# EAGLE design Crimson_module (EAGLE 9.4.0)
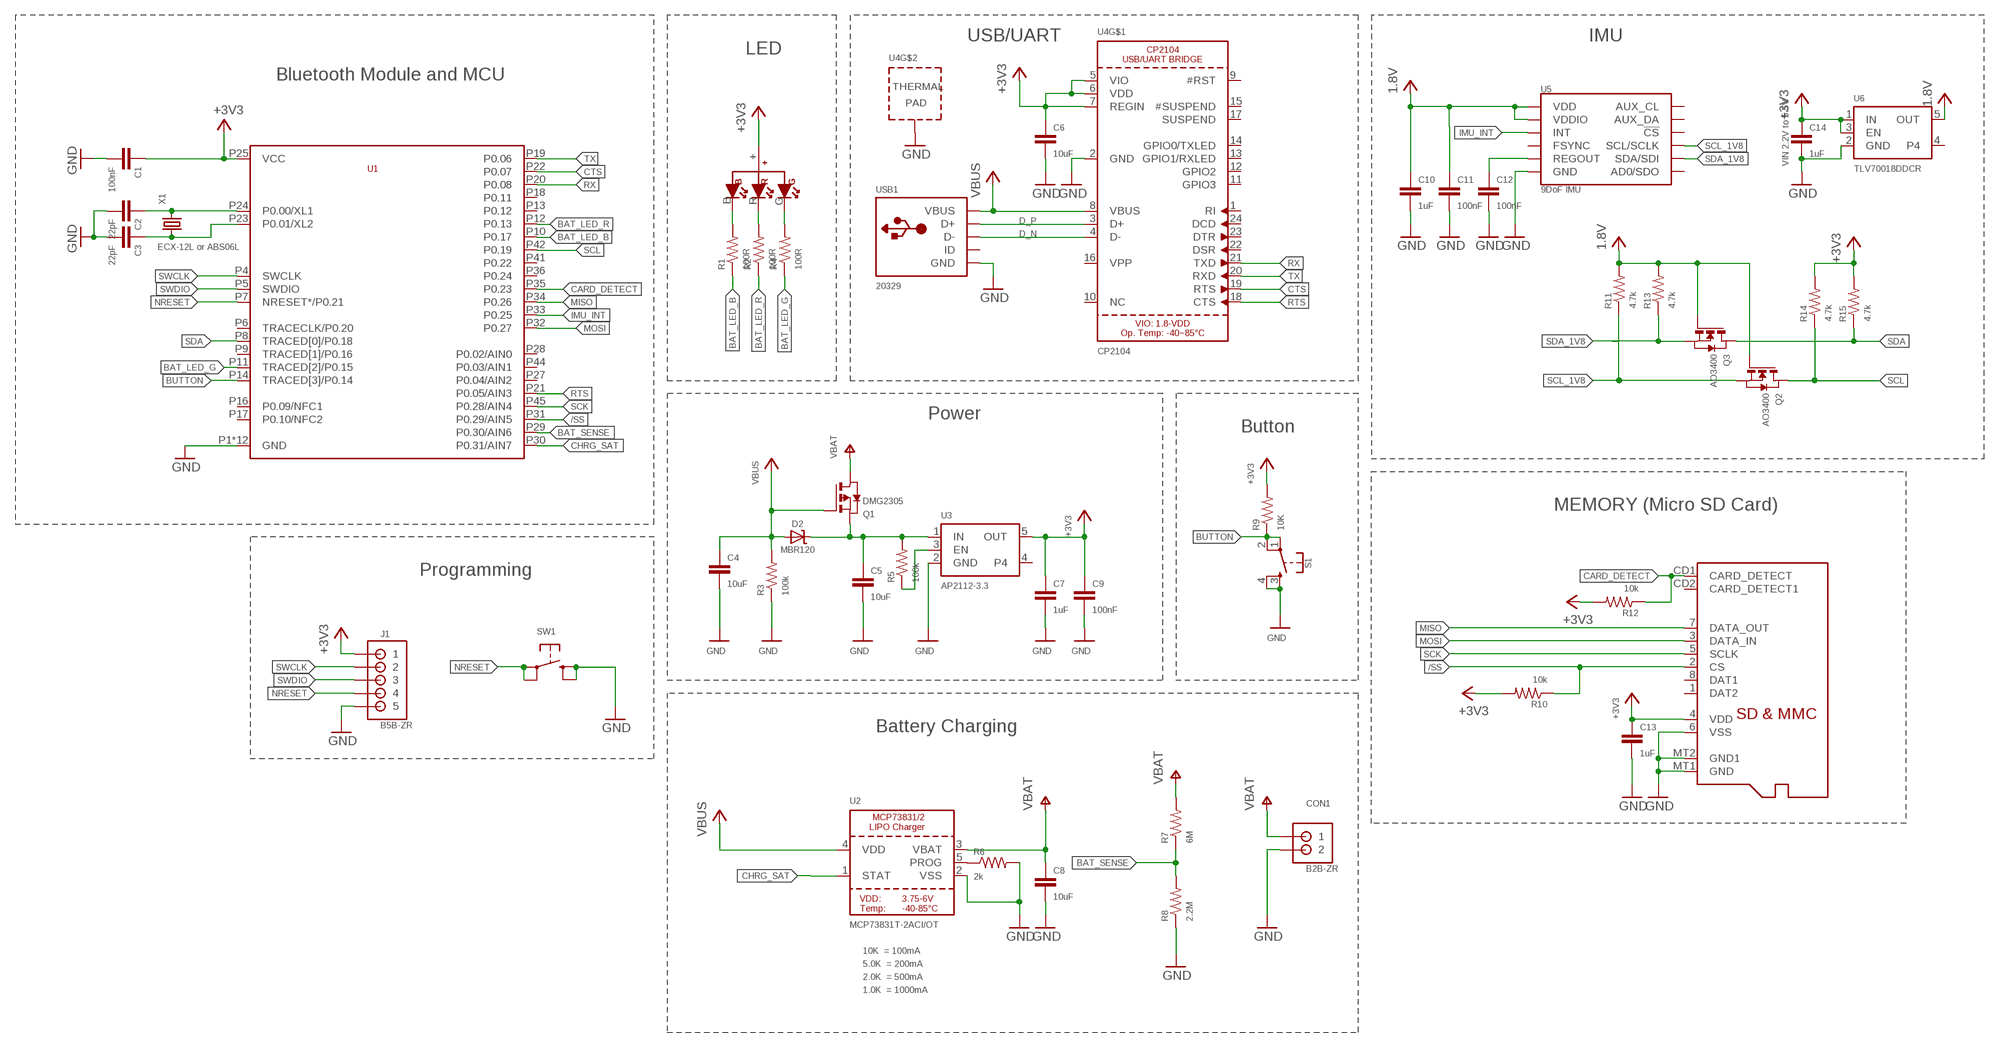
[diagram p0: schematic, sheet 1]

## Parts
C1  100nF  C-EUC0402  [C0402]
C2  22pF  C-EUC0402  [C0402]
C3  22pF  C-EUC0402  [C0402]
C4  10uF  C-EUC0402  [C0402]
C5  10uF  C-EUC0402  [C0402]
C6  10uF  C-EUC0402  [C0402]
C7  1uF  C-EUC0402  [C0402]
C8  10uF  C-EUC0402  [C0402]
C9  100nF  C-EUC0402  [C0402]
C10  1uF  C-EUC0402  [C0402]
C11  100nF  C-EUC0402  [C0402]
C12  100nF  C-EUC0402  [C0402]
C13  1uF  C-EUC0402  [C0402]
C14  1uF  C-EUC0402  [C0402]
CON1  B2B-ZR  [B2B-ZR]
D1  B2020RGBA  [B2020RGBA]
D2  MBR120  DIODE-SCHOTTKYSOD-123  [SOD-123]
J1  B5B-ZR  [B5B-ZR]
Q1  DMG2305  PMOS-SOT23  [SOT-23]
Q2  AO3400  NMOS-SOT23  [SOT-23]
Q3  AO3400  NMOS-SOT23  [SOT-23]
R1  100R  R-US_R0402  [R0402]
R2  100R  R-US_R0402  [R0402]
R3  100k  R-US_R0402  [R0402]
R4  100R  R-US_R0402  [R0402]
R5  100k  R-US_R0402  [R0402]
R6  2k  R-US_R0402  [R0402]
R7  6M  R-US_R0402  [R0402]
R8  2.2M  R-US_R0402  [R0402]
R9  10K  R-US_R0402  [R0402]
R10  10k  R-US_R0402  [R0402]
R11  4.7k  R-US_R0402  [R0402]
R12  10k  R-US_R0402  [R0402]
R13  4.7k  R-US_R0402  [R0402]
R14  4.7k  R-US_R0402  [R0402]
R15  4.7k  R-US_R0402  [R0402]
S1  MOMENTARY-SWITCH-SPST-2-SMD-5.2MM  [TACTILE_SWITCH_SMD_5.2MM]
SD1  MICROSD  [MICROSD]
SW1  MICROBUILDER_SWITCH_TACT_SMT4.6X2.8  [MICROBUILDER_BTN_KMR2_4.6X2.8]
U1  BMD-350  [BMD-350]
U2  MCP73831T-2ACI/OT  MCP73831/2  [SOT23-5]
U3  AP2112-3.3  VREG_SOT23-5  [SOT23-5]
U4  CP2104  [QFN24_4MM_SMSC]
U5  9DoF IMU  ICM-20948  [QFN24-3X3]
U6  TLV70018DDCR  MICROBUILDER_VREG_SOT23-5  [MICROBUILDER_SOT23-5]
USB1  20329  USB_MICRO_20329_V2  [4UCONN_20329_V2]
X1  ECX-12L or ABS06L  KX-327-RT  [2.0X1.2]

## Nets
+3V3: C1.1 C6.1 C7.1 C9.1 C13.1 C14.1 D1.+ J1.1 R9.2 R10.2 R12.2 R14.2 R15.2 SD1.4(VDD) U1.P25(VCC) U3.5(OUT) U4.5(VIO) U4.6(VDD) U4.7(REGIN) U6.1(IN) U6.3(EN)
+5V: C4.1 D2.A Q1.G R3.2 U2.4(VDD) U4.8(VBUS) USB1.VBUS ; supply symbol labelled VBUS
/SS: R10.1 SD1.2(CS) U1.P31(P0.29/AIN5)
BAT_LED_B: R1.1 U1.P10(P0.17)
BAT_LED_G: R4.1 U1.P11(TRACED[2]/P0.15)
BAT_LED_R: R2.1 U1.P12(P0.13)
BAT_SENSE: R7.1 R8.2 U1.P29(P0.30/AIN6)
BUTTON: R9.1 S1.1 S1.2 U1.P14(TRACED[3]/P0.14)
CARD_DETECT: R12.1 SD1.CD1(CARD_DETECT) U1.P35(P0.23)
CHRG_SAT: U1.P30(P0.31/AIN7) U2.1(STAT)
CTS: U1.P22(P0.07) U4.19(RTS)
D_N: U4.4(D-) USB1.D-
D_P: U4.3(D+) USB1.D+
EN: R5.1 U3.3(EN)
GND: C1.2 C2.2 C3.2 C4.2 C5.2 C6.2 C7.2 C8.2 C9.2 C10.2 C11.2 C12.2 C13.2 C14.2 CON1.2 J1.5 R3.1 R6.2 R8.1 S1.3 S1.4 SD1.6(VSS) SD1.MT1(GND) SD1.MT2(GND1) SW1.B'(S1) SW1.B(S) U1.P1(GND) U1.P2(GND) U1.P3(GND) U1.P15(GND) U1.P26(GND) U1.P37(GND) U1.P38(GND) U1.P39(GND) U1.P40(GND) U1.P43(GND) U1.P46(GND) U1.P47(GND) U2.2(VSS) U3.2(GND) U4.2(GND) U4.THERM(TP) U5.18(GND) U5.20(GND) U6.2(GND) USB1.BASE@1(GND) USB1.BASE@2(GND) USB1.GND USB1.SPRT@1(GND) USB1.SPRT@2(GND) USB1.SPRT@3(GND) USB1.SPRT@4(GND)
IMU_INT: U1.P33(P0.25) U5.12(INT)
MISO: SD1.7(DATA_OUT) U1.P34(P0.26)
MOSI: SD1.3(DATA_IN) U1.P32(P0.27)
N$2: R6.1 U2.5(PROG)
N$4: C12.1 U5.10(REGOUT)
N$5: C3.1 U1.P23(P0.01/XL2) X1.1
N$6: D1.B R1.2
N$7: D1.R R2.2
N$8: D1.G R4.2
N$10: C2.1 U1.P24(P0.00/XL1) X1.2
N$11: C5.1 D2.C Q1.S R5.2 U3.1(IN)
NRESET: J1.4 SW1.A'(P1) SW1.A(P) U1.P7(NRESET*/P0.21)
RTS: U1.P21(P0.05/AIN3) U4.18(CTS)
RX: U1.P20(P0.08) U4.21(TXD)
SCK: SD1.5(SCLK) U1.P45(P0.28/AIN4)
SCL: Q2.D R14.1 U1.P42(P0.19)
SCL_1V8: Q2.S R11.1 U5.23(SCL/SCLK)
SDA: Q3.D R15.1 U1.P8(TRACED[0]/P0.18)
SDA_1V8: Q3.S R13.1 U5.24(SDA/SDI)
SWCLK: J1.2 U1.P4(SWCLK)
SWDIO: J1.3 U1.P5(SWDIO)
TX: U1.P19(P0.06) U4.20(RXD)
V+: C8.1 CON1.1 Q1.D R7.2 U2.3(VBAT) ; supply symbol labelled VBAT
VCC: C10.1 C11.1 Q2.G Q3.G R11.2 R13.2 U5.8(VDDIO) U5.13(VDD) U6.5(OUT) ; supply symbol labelled 1.8V
Unconnected: SD1.1(DAT2) SD1.8(DAT1) SD1.CD2(CARD_DETECT1) U1.P6(TRACECLK/P0.20) U1.P9(TRACED[1]/P0.16) U1.P13(P0.12) U1.P16(P0.09/NFC1) U1.P17(P0.10/NFC2) U1.P18(P0.11) U1.P27(P0.04/AIN2) U1.P28(P0.02/AIN0) U1.P36(P0.24) U1.P41(P0.22) U1.P44(P0.03/AIN1) U3.4 U4.1(RI) U4.9(#RST) U4.10(NC) U4.11(GPIO3) U4.12(GPIO2) U4.13(GPIO1/RXLED) U4.14(GPIO0/TXLED) U4.15(#SUSPEND) U4.16(VPP) U4.17(SUSPEND) U4.22(DSR) U4.23(DTR) U4.24(DCD) U5.7(AUX_CL) U5.9(AD0/SDO) U5.11(FSYNC) U5.21(AUX_DA) U5.22(!CS) U6.4 USB1.ID

## Notes on the sheet
- USB/UART | IMU
- LED
- Bluetooth Module and MCU
- VIN 2.2V to 5.5V
- Power
- Button
- MEMORY (Micro SD Card)
- Programming
- Battery Charging
- 10K  = 100mA
- 5.0K  = 200mA
- 2.0K  = 500mA
- 1.0K  = 1000mA

## Library data of the parts
C1-C14 = rcl:C-EU: CAPACITOR, European symbol; SPICEPREFIX: C
CON1 = con-jst-zh:B2B-ZR: JST-ZH Connector 2 pol, 1.5mm pitch Package: B2B-ZR Source: http://www.jst-mfg.com/product/pdf/eng/eZH.pdf
D1 = LED:B2020RGBA
D2 = microbuilder:DIODE-SCHOTTKY
J1 = con-jst-zh:B5B-ZR: JST-ZH Connector 5 pol, 1.5mm pitch Package: B5B-ZR Source: http://www.jst-mfg.com/product/pdf/eng/eZH.pdf
Q1 = MOSFET:PMOS: P-Channel MOSFET
Q2 Q3 = MOSFET:NMOS: N-Channel MOSFET
R1-R15 = rcl:R-US_: RESISTOR, American symbol; SPICEPREFIX: R
S1 = SparkFun-Switches:MOMENTARY-SWITCH-SPST-2: Momentary Switch (Pushbutton) - SPST - Two Circuits Normally-open (NO) SPST momentary switches (buttons, pushbuttons). Schematic symbol includes two switch circuits. Variants SMD-4.6MMX2.8MM - 4.60mm x 2.80mm Tactile Momentary Button Switch - Used on SparkFun SAMD21 Mini Breakout <https://www.sparkfun.com/products/13664> SMD-5.2MM - Mini Pushbutton Switch - SMD <https://www.sparkfun.com/products/8720> - Used on Arduino Pro Mini <https://www.sparkfun.com/products/11114>; PROD_ID: SWCH-08247; SF_SKU: COM-08720
SD1 = adafruit:MICROSD: Micro-SD / Transflash card holder with SPI pinout For the 3M # 2908-05WB-MG and/or 4UCON #19656 push-push type
SW1 = Minniemouse_v2:MICROBUILDER_SWITCH_TACT_SMT: SMT Tact Switches 6x6mm - Digikey: P12940SCT-ND KMR2 (4.6x2.8mm) - Digikey: 401-1426-1-ND EVQ-PQHB55 - Light Touch, 160GF (4.5x4.5mm) - Digikey: P8090SCT-ND KMT0 - KMT021 NGJ LHS (etc.) IP68/Waterproof - Digikey: CKN10289CT-ND
U1 = BMD-350-Eagle:BMD-350
U2 = microbuilder:MCP73831/2: MCP73831/2 LIPO Charger VDD: 3.75 - 6V Temp -40 - 85°C Programmable Charge Rate: 15-500mA NOTE: STAT is a tri-state logic output on the MCP73831 and an open-drain output on the MCP73832. SOT23-5 with 4.2V output and tri-state logic on STAT = MCP73831T-2ACI/OT
U3 = microbuilder:VREG_SOT23-5: SOT23-5 Fixed Voltage Regulators Part Current Out V Out V In V Dropout θJA (°C/W) TJ (°C) Digikey Part No. ADP121 150mA 3.3V 3.4-5.5V 0.09V @ 150mA -- -- ADP121-AUJZ33R7CT-ND ADP121 150mA 3.0V 3.1-5.5V 0.09V @ 150mA -- -- ADP121-AUJZ30R7CT-ND ADP122 300mA 3.3V 3.4-5.5V 0.085V @ 300mA -- -- ADP122AUJZ-3.3-R7CT-ND ADP1712 300mA 3.3V 3.5-5.5V 0.17V @ 300mA -- -- ADP1712AUJZ-3.3-R7TR-ND AP7311 (Low Cost) 150mA 3.3V 3.5-6V 0.15V @ 150mA -- -- AP7311-33WG-7DICT-ND LD39015M18R 150mA 1.8V 1.9V-5.5V 0.08V @ 100mA -- -- 497-6977-1-ND LP2985A-33DBVR 150mA 3.3V 3.3-16V 0.28V @ 150mA 206 150 296-18479-1-ND MCP1824T-3302E/OT 300mA 3.3V 3.5V-6V 0.2V @ 300mA -- -- MCP1824T-3302E/OTCT-ND MIC5205-2.5YM5 TR 150mA 2.5V 2.7-16V 0.165V @ 150mA -- -- 576-1257-2-ND MIC5205-3.0YM5 TR 150mA 3.0V 3.2V-16V 0.165V @ 150mA -- -- 576-1258-2-ND MIC5205-3.3YM5 TR 150mA 3.3V 3.5V-16V 0.165V @ 150mA -- -- 576-1259-2-ND TPS780330220 150mA 3.3V+2.2V 3.6-5.5V 250mV Max -- -- 296-23332-1-ND TDA3663/N1,135 100mA 3.3V 3.5-45V 0.18V @ 50mA -- -- 568-5343-1-ND Max operating temp can be calculated using θJA, TJ (max junction temperature), and power in watts. Set the "Maximum Ambient Temperature" until it reaches TJ ("Max Junction Temperature"), which is the absolute limit for safe use of the regulator: Heat Sink Temperature Calculator <http://www.daycounter.com/Calculators/Heat-Sink-Temperature-Calculator.phtml> For example, With 12V source into a 3.3V LP2985 and a 30mA load, we are dissipating (12V-3.3V) * 0.03A = 0.261W. With a θJA of 206 °C/W, a TJ of 150°C, and 261mW we can safely use the chip without a heat sink up to 75°C (=147.1°C Junction Temperature).
U4 = microbuilder:CP2104: CP2104 - USB to UART Bridge VDD Output: 3.45V
U5 = SparkFun-Sensors:ICM-20948: ICM-20948 9 Degree of Freedom IMU World’s lowest power 9-axis MotionTracking device that is ideally suited for smartphones, tablets, wearable sensors, and IoT applications. Includes onboard Digital Motion Processor to offload computations from the host processor Datasheet <https://cdn.sparkfun.com/assets/learn_tutorials/5/5/0/MPU9250REV1.0.pdf> SparkFun Products: SparkFun IMU Breakout - ICM-20948 <https://www.sparkfun.com/products/15182>; PROD_ID: IC-14247
U6 = Adafruit ESP8266 Feather rev E:MICROBUILDER_VREG_SOT23-5: SOT23-5 Fixed Voltage Regulators Part Current Out V Out V In V Dropout θJA (°C/W) TJ (°C) Digikey Part No. ADP121 150mA 3.3V 3.4-5.5V 0.09V @ 150mA -- -- ADP121-AUJZ33R7CT-ND ADP121 150mA 3.0V 3.1-5.5V 0.09V @ 150mA -- -- ADP121-AUJZ30R7CT-ND ADP122 300mA 3.3V 3.4-5.5V 0.085V @ 300mA -- -- ADP122AUJZ-3.3-R7CT-ND ADP1712 300mA 3.3V 3.5-5.5V 0.17V @ 300mA -- -- ADP1712AUJZ-3.3-R7TR-ND AP7311 (Low Cost) 150mA 3.3V 3.5-6V 0.15V @ 150mA -- -- AP7311-33WG-7DICT-ND LD39015M18R 150mA 1.8V 1.9V-5.5V 0.08V @ 100mA -- -- 497-6977-1-ND LP2985A-33DBVR 150mA 3.3V 3.3-16V 0.28V @ 150mA 206 150 296-18479-1-ND MCP1824T-3302E/OT 300mA 3.3V 3.5V-6V 0.2V @ 300mA -- -- MCP1824T-3302E/OTCT-ND MIC5205-2.5YM5 TR 150mA 2.5V 2.7-16V 0.165V @ 150mA -- -- 576-1257-2-ND MIC5205-3.0YM5 TR 150mA 3.0V 3.2V-16V 0.165V @ 150mA -- -- 576-1258-2-ND MIC5205-3.3YM5 TR 150mA 3.3V 3.5V-16V 0.165V @ 150mA -- -- 576-1259-2-ND TPS780330220 150mA 3.3V+2.2V 3.6-5.5V 250mV Max -- -- 296-23332-1-ND TDA3663/N1,135 100mA 3.3V 3.5-45V 0.18V @ 50mA -- -- 568-5343-1-ND Max operating temp can be calculated using θJA, TJ (max junction temperature), and power in watts. Set the "Maximum Ambient Temperature" until it reaches TJ ("Max Junction Temperature"), which is the absolute limit for safe use of the regulator: Heat Sink Temperature Calculator <http://www.daycounter.com/Calculators/Heat-Sink-Temperature-Calculator.phtml> For example, With 12V source into a 3.3V LP2985 and a 30mA load, we are dissipating (12V-3.3V) * 0.03A = 0.261W. With a θJA of 206 °C/W, a TJ of 150°C, and 261mW we can safely use the chip without a heat sink up to 75°C (=147.1°C Junction Temperature).
USB1 = microbuilder:USB: USB Connectors USBMINIB - Surface Mount Female Mini-B USB Connector 4UConnector: 06564
X1 = crystal-geyer_V1_0:KX-327: Tuning Fork Crystals (kHz) SMD: KX327 - Serie Model Size l/w/h [mm] Frequency Range Frequency Stability Temp. Range [°C] Load Capacitance AECQ 200 availabel Datasheet KX-327VT KX-327FT KX-327RT KX-327NHT KX-327NHF KX-327L KX-327S 1.25/1.05/0.5 1.6/1.0/0.5 2.0/1.2/0.6 3.2/1.5/0.8 3.2/1.5/0.8 7.0/1.5/1.4 8.2/3.8/2.5 32,768 kHz 32,768 kHz 32,768 kHz 32,768 kHz 32,768 kHz 32,768 kHz 32,768 kHz ±10 … ±20ppm ±10 … ±20ppm ±10 … ±20ppm ±10 … ±20ppm ±10 … ±20ppm ±10 … ±20ppm ±5 … ±20ppm (*) -40°C …+85°C (*) -40°C …+85°C (*) -40°C …+85°C (*) -40°C …+85°C (*) -40°C …+125°C (*) -40°C …+85°C (*) -40°C …+85°C 7/9/12,5 7/9/12,5 7/9/12,6 7/9/12,5 9/12,5 7/9/12,5 6/12,5 - - - - yes - - KX-327VT.pdf <http://www.geyer-electronic.de/uploads/tx_userartikelfrequenz/GEYER-KX-327VT.pdf> KX-327FT.pdf <http://www.geyer-electronic.de/uploads/tx_userartikelfrequenz/GEYER-KX-327FT.pdf> KX-327RT.pdf <http://www.geyer-electronic.de/uploads/tx_userartikelfrequenz/GEYER-KX-327RT.pdf> KX-327NHT.pdf <http://www.geyer-electronic.de/uploads/tx_userartikelfrequenz/GEYER-KX-327NHT.pdf> KX-327NHF.pdf <http://www.geyer-electronic.de/uploads/tx_userartikelfrequenz/GEYER-KX-327NHF.pdf> KX-327L.pdf <http://www.geyer-electronic.de/uploads/tx_userartikelfrequenz/GEYER-KX-327L.pdf> KX-327S.pdf <http://www.geyer-electronic.de/uploads/tx_userartikelfrequenz/GEYER-KX-327S.pdf> <http://www.geyer-electronic.de/fileadmin/template/img/logo-geyer-electronic.png> Details see: http://www.geyer-electronic.de/Frequenz-Produkte.9.0.html Created 2016-06-07, Hans Locher 2016 (C) Geyer Quartz Technology KX327VT,KX327FT,KX327RT,KX327NHT,KX327NHF,KX327S,KX327L;125105;1610;2012;3215;7015;8238;1,25x1,05,1.25x1.05;1,6x1,0,1.6x1.0;2,0x1,2,2.0x1.2;3,2x1,5,3.2x1.5;8,2x3,8,8.2x3.8,7.0x1.5,7,0x1,532.768kHz

## Board
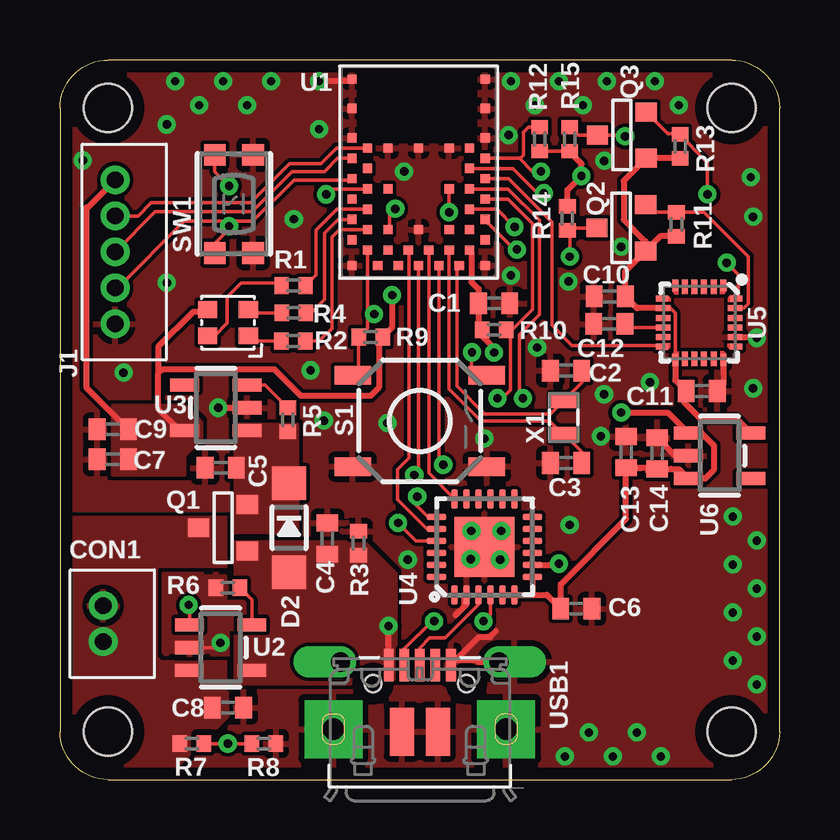
[diagram p1: board, top side]
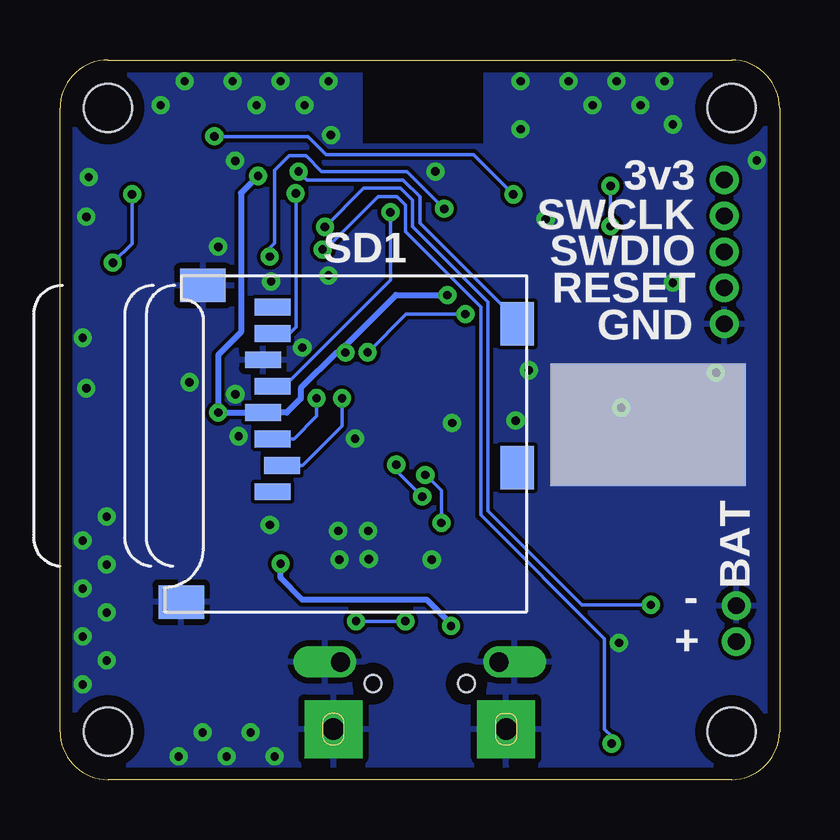
[diagram p2: board, bottom side, seen from below]

Size 30 x 30 mm. Coordinates in mm from the lower left corner, seen from the top.
Outline: 0,28 0,15 0,2 arc90 2,0 15,0 28,0 arc90 30,2 30,15 30,28 arc90 28,30 15,30 2,30 arc90 0,28
Copper layers (1*16): Top 0.035mm / dielectric 1.5mm / Bottom 0.035mm
Design rules "default *": minimum track width 6mil, minimum drill 0.35mm, track to track 6mil, track to pad 4mil, pad to pad 4mil, via to via 6mil, smd to smd 6mil, copper to edge 20mil, drill to drill 6mil, minimum pad ring 10mil, minimum via ring 8mil, stop-mask expansion 4mil, vias tented up to drill 0.4mm, thermal gap 10mil
Holes 2 mm at 2,2 28,2 28,28 2,28

### Footprints (pad centres in the part's own frame; a part is rotated, then mirrored left to right if it is on the bottom)
C0402 = smd 0.7 x 0.9: 1 -0.65,0; 2 0.65,0
B2B-ZR = drill 0.7 pad 1.1: 1 -0.75,-1.3; 2 0.75,-1.3
B2020RGBA = smd 0.8 x 0.7: + -0.85,0.55; B -0.85,-0.55; G 0.85,0.55; R 0.85,-0.55
SOD-123 = smd 1.4 x 1.4: A 1.85,0; C -1.85,0
B5B-ZR = drill 0.7: 1 7.5,-1.3; 2 6,-1.3; 3 4.5,-1.3; 4 3,-1.3; 5 1.5,-1.3
SOT-23 = smd 0.787 x 0.889: D 0,1.016; G -0.965,-1.016; S 0.965,-1.016
R0402 = smd 0.6 x 0.7: 1 -0.5,0; 2 0.5,0
TACTILE_SWITCH_SMD_5.2MM = smd 1.524 x 0.762: 1 -2.794,1.905; 2 2.794,1.905; 3 -2.794,-1.905; 4 2.794,-1.905
MICROSD = smd 0.7 x 1.5: 1 9,-10.64; 2 7.9,-10.24; 3 6.8,-10.64; 4 5.7,-11.04; 5 4.6,-10.64; 6 3.5,-11.04; 7 2.4,-10.64; 8 1.3,-10.64 | smd 1.8 x 1.4: CD1 2,-0.44; CD2 8,-0.44 | smd 1.4 x 1.9: MT1 0.4,-13.54; MT2 13.6,-14.44
MICROBUILDER_BTN_KMR2_4.6X2.8 = smd 0.9 x 0.9: A 2.05,0.8; A' -2.05,0.8; B 2.05,-0.8; B' -2.05,-0.8
BMD-350 = smd 0.39 x 0.39: P1 0.425,8.2; P2 0.425,6.975; P3 0.425,5.75; P4 1.075,5.325; P5 0.425,4.9; P6 1.075,4.475; P7 0.425,4.05; P8 1.075,3.625; P9 0.425,3.2; P10 1.075,2.775; P11 0.425,2.35; P12 1.075,1.925; P13 0.425,1.5; P14 1.075,1.075; P15 0.425,0.425; P16 1.5,0.425; P17 1.925,1.075; P18 2.35,0.425; P19 2.775,1.075; P20 3.2,0.425; P21 3.625,1.075; P22 4.05,0.425; P23 4.475,1.075; P24 4.9,0.425; P25 5.325,1.075; P26 5.975,0.425; P27 5.975,1.5; P28 5.325,1.925; P29 5.975,2.35; P30 5.325,2.775; P31 5.975,3.2; P32 5.325,3.625; P33 5.975,4.05; P34 5.325,4.475; P35 5.975,4.9; P36 5.325,5.325; P37 5.975,5.75; P38 5.975,6.975; P39 5.975,8.2; P40 1.925,5.325; P41 1.925,3.625; P42 1.925,1.925; P43 3.2,1.925; P44 4.475,1.925; P45 4.475,3.625; P46 4.475,5.325; P47 3.2,5.325
SOT23-5 = smd 0.55 x 1.2: 1 -0.95,-1.3; 2 0,-1.3; 3 0.95,-1.3; 4 0.95,1.3; 5 -0.95,1.3
QFN24_4MM_SMSC = smd 0.8 x 0.28: 1 -2,1.25; 2 -2,0.75; 3 -2,0.25; 4 -2,-0.25; 5 -2,-0.75; 6 -2,-1.25; 13 2,-1.25; 14 2,-0.75; 15 2,-0.25; 16 2,0.25; 17 2,0.75; 18 2,1.25 | smd 0.28 x 0.8: 7 -1.25,-2; 8 -0.75,-2; 9 -0.25,-2; 10 0.25,-2; 11 0.75,-2; 12 1.25,-2; 19 1.25,2; 20 0.75,2; 21 0.25,2; 22 -0.25,2; 23 -0.75,2; 24 -1.25,2 | smd 2.5 x 2.5: THERM 0,0
QFN24-3X3 = smd 0.495 x 0.25: 1 -1.552,1; 6 -1.552,-1; 13 1.552,-1; 18 1.552,1 | smd 0.6 x 0.25: 2 -1.5,0.6; 3 -1.5,0.2; 4 -1.5,-0.2; 5 -1.5,-0.6; 14 1.5,-0.6; 15 1.5,-0.2; 16 1.5,0.2; 17 1.5,0.6 | smd 0.25 x 0.495: 7 -1,-1.552; 12 1,-1.552; 19 1,1.552; 24 -1,1.552 | smd 0.25 x 0.6: 8 -0.6,-1.5; 9 -0.2,-1.5; 10 0.2,-1.5; 11 0.6,-1.5; 20 0.6,1.5; 21 0.2,1.5; 22 -0.2,1.5; 23 -0.6,1.5
MICROBUILDER_SOT23-5 = smd 0.55 x 1.2: 1 -0.95,-1.3; 2 0,-1.3; 3 0.95,-1.3; 4 0.95,1.3; 5 -0.95,1.3
4UCONN_20329_V2 = smd 1 x 2: BASE@1 -0.75,-2; BASE@2 0.75,-2 | smd 0.4 x 1.35: D+ 0,0.775; D- -0.65,0.775; GND 1.3,0.775; ID 0.65,0.775; VBUS -1.3,0.775 | drill 0.8 pad 1.143 offset: SPRT@1 -3.3,0.9; SPRT@2 3.3,0.9 | drill 0.9 pad 2.413 square: SPRT@3 -3.6,-1.9; SPRT@4 3.6,-1.9 | hole 0.7: -1.95,0; 1.95,0
2.0X1.2 = smd 0.6 x 1.1: 1 -0.7,0; 2 0.7,0

### Placement (x,y rotation side)
C1  18.1,19.85 0 top
C2  21.1,17.05 180 top
C3  21.1,13.2 180 top
C4  11.15,10.05 90 top
C5  6.7,13 180 top
C6  21.52,7.12 0 top
C7  2.2,13.35 180 top
C8  7,3 0 top
C9  2.2,14.6 180 top
C10  22.92,20.14 180 top
C11  26.75,16.2 0 top
C12  22.9,19 180 top
C13  23.6,13.65 90 top
C14  24.9,13.6 90 top
CON1  0.5,6.5 90 top
D1  7,19.05 0 top
D2  9.55,10.5 270 top
J1  1,17.5 90 top
Q1  6.8,10.5 90 top
Q2  23.4,23 90 top
Q3  23.43,26.86 90 top
R1  9.74,20.59 180 top
R2  9.72,18.29 180 top
R3  12.45,9.85 270 top
R4  9.75,19.45 180 top
R5  9.5,15 270 top
R6  7,8 180 top
R7  5.5,1.5 180 top
R8  8.5,1.5 180 top
R9  12.95,18.45 0 top
R10  18.1,18.75 180 top
R11  25.7,23.15 270 top
R12  20,26.7 270 top
R13  25.85,26.4 270 top
R14  21.15,23.4 90 top
R15  21.25,26.7 270 top
S1  15,14.95 0 top
SD1  10.5,21 270 bottom
SW1  7.25,24 90 top
U1  11.75,21 0 top
U2  6.7,5.5 270 top
U3  6.5,15.5 90 top
U4  17.7,9.7 90 top
U5  26.65,19.05 270 top
U6  27.5,13.5 270 top
USB1  15,4 0 top
X1  21,15.1 90 top

### Tracks (layer width: path | path; a pad name or v marks a point on that pad's centre or on a via)
+3V3  (via drill 0.35)
  Top 0.152: R15.2 21.4,26.05 R15.2 | R15.2 R12.2 | R10.2 17.7,18.75
  Top 0.254: 21.4,26.05 R15.2 21.25,26.16 21.74,25.67 v21.74,25.16 21.15,24.57 R14.2 | R14.2 | 21.1,23.95 R14.2 | 24.77,13.07 C14.1 25.48,12.95 25.8,12.95 U6.3 26.9,12.55 27.25,12.9 27.25,13.95 | 27.25,13.95 | 27.25,13.95 26.75,14.45 U6.1 25.35,15.3 v23.4,15.3 | U4.5 U4.6 19.7,7.7 | 19.7,7.7 20.3,7.7 C6.1 20.88,8.14 23.6,10.87 23.6,12.95 23.65,13 24.23,13 | U4.7 19.7,7.7 | 24.52,12.82 24.77,13.07 | 24.77,13.07 24.7,13 24.23,13 | U1.P25 17.15,22 17.15,20.75 17.45,20.45 C1.1 17.45,19.7 | J1.1 1.15,23.85 1.1,23.85 1.1,16.35 C9.1 | D1.+ 6.05,19.5 5.55,19.5 4.1,18.05 4.1,16.95 | 4.1,16.95 4.1,15.45 5,14.55 U3.5 | 4.1,16.95 4.25,17.1 8.95,17.1 10.04,16 12.95,16 13.3,16.35 13.3,18.3 R9.2 13.85,18.85 13.85,20 v13.85,20.2 | 17.45,19.7 17.45,19.6 | 17.45,19.7 17.4,19.75 | v18.1,17.8 18.1,18 17.6,18.5 R10.2 17.45,18.9 17.45,19.7 | 24.23,13 C13.1
  Bottom 0.254: v13.85,20.2 16,20.2 18.1,18.1 v18.1,17.8 18.47,17.8 19.96,16.31 19.96,15.88 20.55,15.3 SD1.4 v23.4,15.3 23.4,17.7 22.45,18.65 22.45,24.45 v21.74,25.16
  pour Top (no thermals): 2.2,15.6 2.2,12.7 5.2,12.7 5.2,13.5 5.9,14.2 5.9,14.9 5.2,15.6
+5V  (via drill 0.35)
  Top 0.254: USB1.VBUS v13.7,6.4 | v20.8,9 20.75,8.95 U4.8
  Bottom 0.254: v13.7,6.4 13.7,6.5 14.7,7.5 19.9,7.5 20.8,8.4 v20.8,9
  pour Top (no thermals): 7.3,9.9 12.7,9.9 14,8.6 14,4 7.3,4
/SS  (via drill 0.35)
  Top 0.152: U1.P31 18.68,24.2 19.69,23.19 19.69,19.6 18.84,18.75 R10.1 18.78,18.57 18.78,16.24 18.6,16.05 | v18.24,15.89 18.44,15.89 18.6,16.05 | 18.74,16.2 18.6,16.05
  Bottom 0.152: v18.24,15.89 18.24,14.75 19.89,13.1 SD1.2
BAT_LED_B
  Top 0.152: R1.1 10.68,21.04 10.68,22.91 11.54,23.77 U1.P10
BAT_LED_G
  Top 0.152: U1.P11 11.6,23.35 11.03,22.78 11.03,20.01 10.47,19.45 R4.1
BAT_LED_R
  Top 0.152: U1.P12 11.65,22.93 11.33,22.61 11.33,18.81 10.81,18.29 R2.1
BAT_SENSE  (via drill 0.35)
  Top 0.152: v19.05,22.1 18.94,22.1 17.73,23.32 U1.P29 | R7.1 v7,1.5 R8.2
  Bottom 0.152: v19.05,22.1 18.95,22.1 16.75,24.3 15.96,24.3 15.6,23.95 15.6,22.85 12.46,19.7 12.46,11.02 7.3,5.87 7.3,2.1 7,1.8 | 7,1.8 7,1.7 | v7,1.5 7,1.8
BUTTON  (via drill 0.35)
  Top 0.152: U1.P14 12.82,19.4 | 12.82,19.4 12.82,18.82 R9.1 12.45,17.1 S1.1 | v17.18,17.81 17.16,17.79 17.16,16.86 S1.2 | v13.1,19.41 v13.1,19.4 12.82,19.4
  Bottom 0.152: v17.18,17.81 17.16,17.81 15.57,19.41 v13.1,19.41
CARD_DETECT  (via drill 0.35)
  Top 0.152: v20.05,25.35 19.7,25.35 19.15,25.9 | 19.15,25.9 19.2,25.9 19.32,26.02 19.32,27 19.53,27.2 R12.1 | 19.15,25.9 U1.P35
  Bottom 0.152: SD1.CD1 10.94,19.15 14.99,23.2 14.99,24.3 15.69,25 19.7,25 v20.05,25.35
CHRG_SAT  (via drill 0.35)
  Top 0.152: U2.1 5.4,7.28 v5.37,7.28 | U1.P30 18.22,23.77 v18.95,23.04
  Bottom 0.152: v5.37,7.28 8.23,7.28 12.15,11.2 12.15,19.9 15.3,23.05 15.3,24.15 15.8,24.65 17.34,24.65 v18.95,23.04
CTS  (via drill 0.35)
  Top 0.152: U4.19 15.35,10.95 14.85,11.45 14.85,11.75 v14.9,11.8 | v15.98,13.13 15.8,13.31 U1.P22
  Bottom 0.152: v15.98,13.13 15.98,12.88 v14.9,11.8
D_N  (via drill 0.35)
  Top 0.152: USB1.D- 14.35,5.45 15.5,6.6 v15.6,6.6 | v17.66,6.6 17.95,6.89 U4.4
  Bottom 0.152: v17.66,6.6 v15.6,6.6
D_P
  Top 0.152: U4.3 17.45,7.3 16.05,5.9 15.4,5.9 15,5.5 USB1.D+
EN
  Top 0.152: R5.1 8.55,16.45 U3.3
GND  (via drill 0.35)
  Top 0.152: v6.69,5.7 6.49,5.5 U2.2 | 14.35,25.65 v14.35,25.35 | U4.THERM 17.19,9.19 v17.12,9.19 | U4.THERM 17.81,9.7 v18.35,9.16 | U4.THERM 17.15,10.25 v17.15,10.36
  Top 0.254: U3.2 v6.6,15.5 | U1.P1 12.18,29.11 v10.8,29.11 | v29.06,18.41 v29.05,18.41 29.01,18.45 U5.20 | U5.18 27.65,16.45 C11.2 | C14.2 25.65,13.5 U6.2 | USB1.SPRT@2 17.44,4.9 17.36,4.99 16.51,4.99 USB1.GND 17.47,5.94 17.93,5.94 18.17,6.18 | U4.2 16.95,7.3 16.5,6.85 16.87,7.22 16.87,7.62 U4.2
  Bottom 0.152: v14.35,25.35 14.45,25.45
  other vias: 10.8,27.11 8.8,29.11 6.8,29.11 4.8,29.11 5.8,28.11 7.8,28.11 18.8,29.11 18.7,26.87 20.8,29.11 19.8,28.11 21.8,28.11 22.8,29.11 24.8,29.11 25.8,28.11 28.8,25.11 4.45,27.31 0.95,25.81 4.45,20.71 2.65,16.96 9.75,23.36 11,14.96 13.65,14.86 17.7,14.21 18.4,10.36 14.5,9.16 21.05,0.96 23.05,0.96 25.05,0.96 24.05,1.96 22.05,1.96 29.05,3.96 29.05,5.96 28.05,4.96 29.05,7.96 29.05,9.96 28.05,8.96 28.05,6.96 28.05,10.96 21.25,10.61 22.55,14.31 22.69,16.06 24.6,16.56 21.2,20.76 23.4,22.21 28.9,23.46 28.9,16.31 10.45,17.06 18.8,21.01 19.89,18.01 22.7,25.8
  pour Top (no thermals): 4.4,8.5 6.9,8.5 6.9,5.3 4.5,5.3 4.4,5.4
  pour Top (rank 3): -1.15,31.3 32.8,31.3 32.8,-2.4 -1.15,-2.4
  pour Bottom: 0,31 0,-2 31,-2 31,31
IMU_INT
  Top 0.152: U1.P33 18.7,25.05 20.5,23.25 20.5,18.95 21.35,18.1 24.79,18.1 | 24.79,18.1 24.87,18.1 | 24.92,18.05 24.87,18.1 | 24.79,18.1 24.87,18.1 | 24.87,18.1 24.92,18.05 | U5.12 24.92,18.05
MISO  (via drill 0.35)
  Top 0.152: v20.17,24.44 19.92,24.44 18.88,25.48 U1.P34
  Bottom 0.152: SD1.7 20.42,18.6 20.15,18.87 20.15,24.41 v20.17,24.44
MOSI  (via drill 0.35)
  Top 0.152: U1.P32 18.68,24.62 20,23.31 20,19.39 19.15,18.55 19.15,16.04 v19.3,15.89
  Bottom 0.152: v19.3,15.89 19.3,15.15 20.25,14.2 SD1.3
N$2
  Top 0.152: R6.1 8,7.5 U2.5
N$4
  Top 0.152: U5.10 23.7,18.85 C12.1
N$5
  Top 0.152: U1.P23 16.23,16.27 17.55,14.95 20.41,14.95 20.95,14.4 X1.1 21.75,13.65 C3.1
N$6
  Top 0.152: R1.2 9.13,20.7 7.55,20.7 6.97,20.12 6.97,19.02 6.45,18.5 D1.B
N$7
  Top 0.152: R2.2 8.06,18.29 D1.R
N$8
  Top 0.152: R4.2 8,19.45 D1.G
N$10
  Top 0.152: U1.P24 16.55,21.32 16.55,16.4 17.7,15.25 20.45,15.25 X1.2 21.75,16.55 C2.1
N$11
  pour Top (no thermals): 7.3,14.8 9.9,14.8 9.9,10.3 7.3,10.3
NRESET  (via drill 0.35)
  Top 0.152: U1.P7 12.12,25 9.76,25 8.04,23.27 7.05,23.27 | J1.4 2.4,20.5 5.17,23.27 7.05,23.27 | SW1.A' 6.45,22.35 7.05,22.95 | 7.05,22.95 7.05,23.27 | 7.05,22.95 v7.05,23.07 | SW1.A 6.45,25.35 v7.05,24.75
  Bottom 0.152: v7.05,23.07 v7.05,24.75
RTS
  Top 0.152: U4.18 15.38,12.78 U1.P21
RX  (via drill 0.35)
  Top 0.152: U4.21 14.85,9.95 v14.1,10.7 | U1.P20 14.95,13.9 | 14.95,13.9 14.95,13.6 | 14.95,13.9 14.95,12.88 v14.77,12.7
  Bottom 0.152: v14.77,12.7 14.75,12.7 14.1,12.05 v14.1,10.7
SCK  (via drill 0.35)
  Top 0.152: U1.P45 v16.23,23.65
  Bottom 0.152: v16.23,23.65 16.23,20.82 20.64,16.4 SD1.5
SCL  (via drill 0.35)
  Top 0.152: v13.98,23.8 13.73,23.55 13.73,22.85 13.65,22.85 13.68,22.87 U1.P42 | v21.26,21.8 21.26,22.79 R14.1 21.15,22.88 21.27,23 Q2.D
  Bottom 0.152: v13.98,23.8 15.53,25.35 19.09,25.35 19.74,26.01 20.44,26.01 21.05,25.4 21.05,22.36 21.26,22.15 v21.26,21.8
SCL_1V8
  Top 0.152: U5.23 28.5,19.65 28.7,19.85 28.7,21.8 26.85,23.65 R11.1 24.7,23.65 24.42,23.94 Q2.S
SDA  (via drill 0.35)
  Top 0.152: U1.P8 11.32,24.62 11.3,24.6 11.2,24.6 11.1,24.5 v11.1,24.39 | R15.1 21.59,26.86 Q3.D 23.52,26.86 v23.56,26.82
  Bottom 0.152: v11.1,24.39 12.76,26.05 18.91,26.05 19.66,26.81 v23.55,26.81 v23.56,26.82
SDA_1V8  (via drill 0.35)
  Top 0.152: U5.24 28.29,20.13 28.29,21.06 28.28,21.06 v27.8,21.54 v27.8,21.55 | v27,24.4 27,25.73 25.8,26.92 25.5,26.92 | R13.1 25.85,26.92 25.5,26.92 | Q3.S 25.35,26.92 25.45,26.92 25.5,26.92
  Bottom 0.152: v27,24.4 27,22.35 v27.8,21.55
SWCLK
  Top 0.152: U1.P4 11.53,26.32 10.88,25.68 9.57,25.68 7.95,24.05 3.8,24.05 3.25,23.5 J1.2
SWDIO
  Top 0.152: J1.3 3.98,23.68 8.01,23.68 9.68,25.35 11.03,25.35 11.57,25.9 U1.P5
TX
  Top 0.152: U4.20 15.3,10.45 14.08,11.67 14.08,12.93 14.55,13.4 14.55,22.05 U1.P19 14.5,22.05
V+
  pour Top (isolate 0.254, rank 2, no thermals): 0,10.9 7,10.9 7,2.7 4.2,-0.1 0,-0.1
VCC
  Top 0.152: U5.13 25.65,19.45 25.45,19.65 U5.8
  Top 0.254: R13.2 Q3.G | Q3.G | Q3.G 23.5,24.96 23.5,23.35 24.42,22.43 Q2.G | R11.2 25.03,22.65 Q2.G | U5.8 24.06,19.65 C10.1 23.57,21.19 Q2.G | 26.02,16.27 C11.1 | 26.02,16.27 25.65,16.65 U5.13 | U6.5 28.2,15.05 26.7,15.05 26.02,15.73 26.02,16.27

### Text on the board
bPlace: 3v3 | SWCLK | SWDIO | RESET | GND | BAT | - | +